# Altium schematic sheet 两个水泵三线切换.SchDoc
size OrCAD B
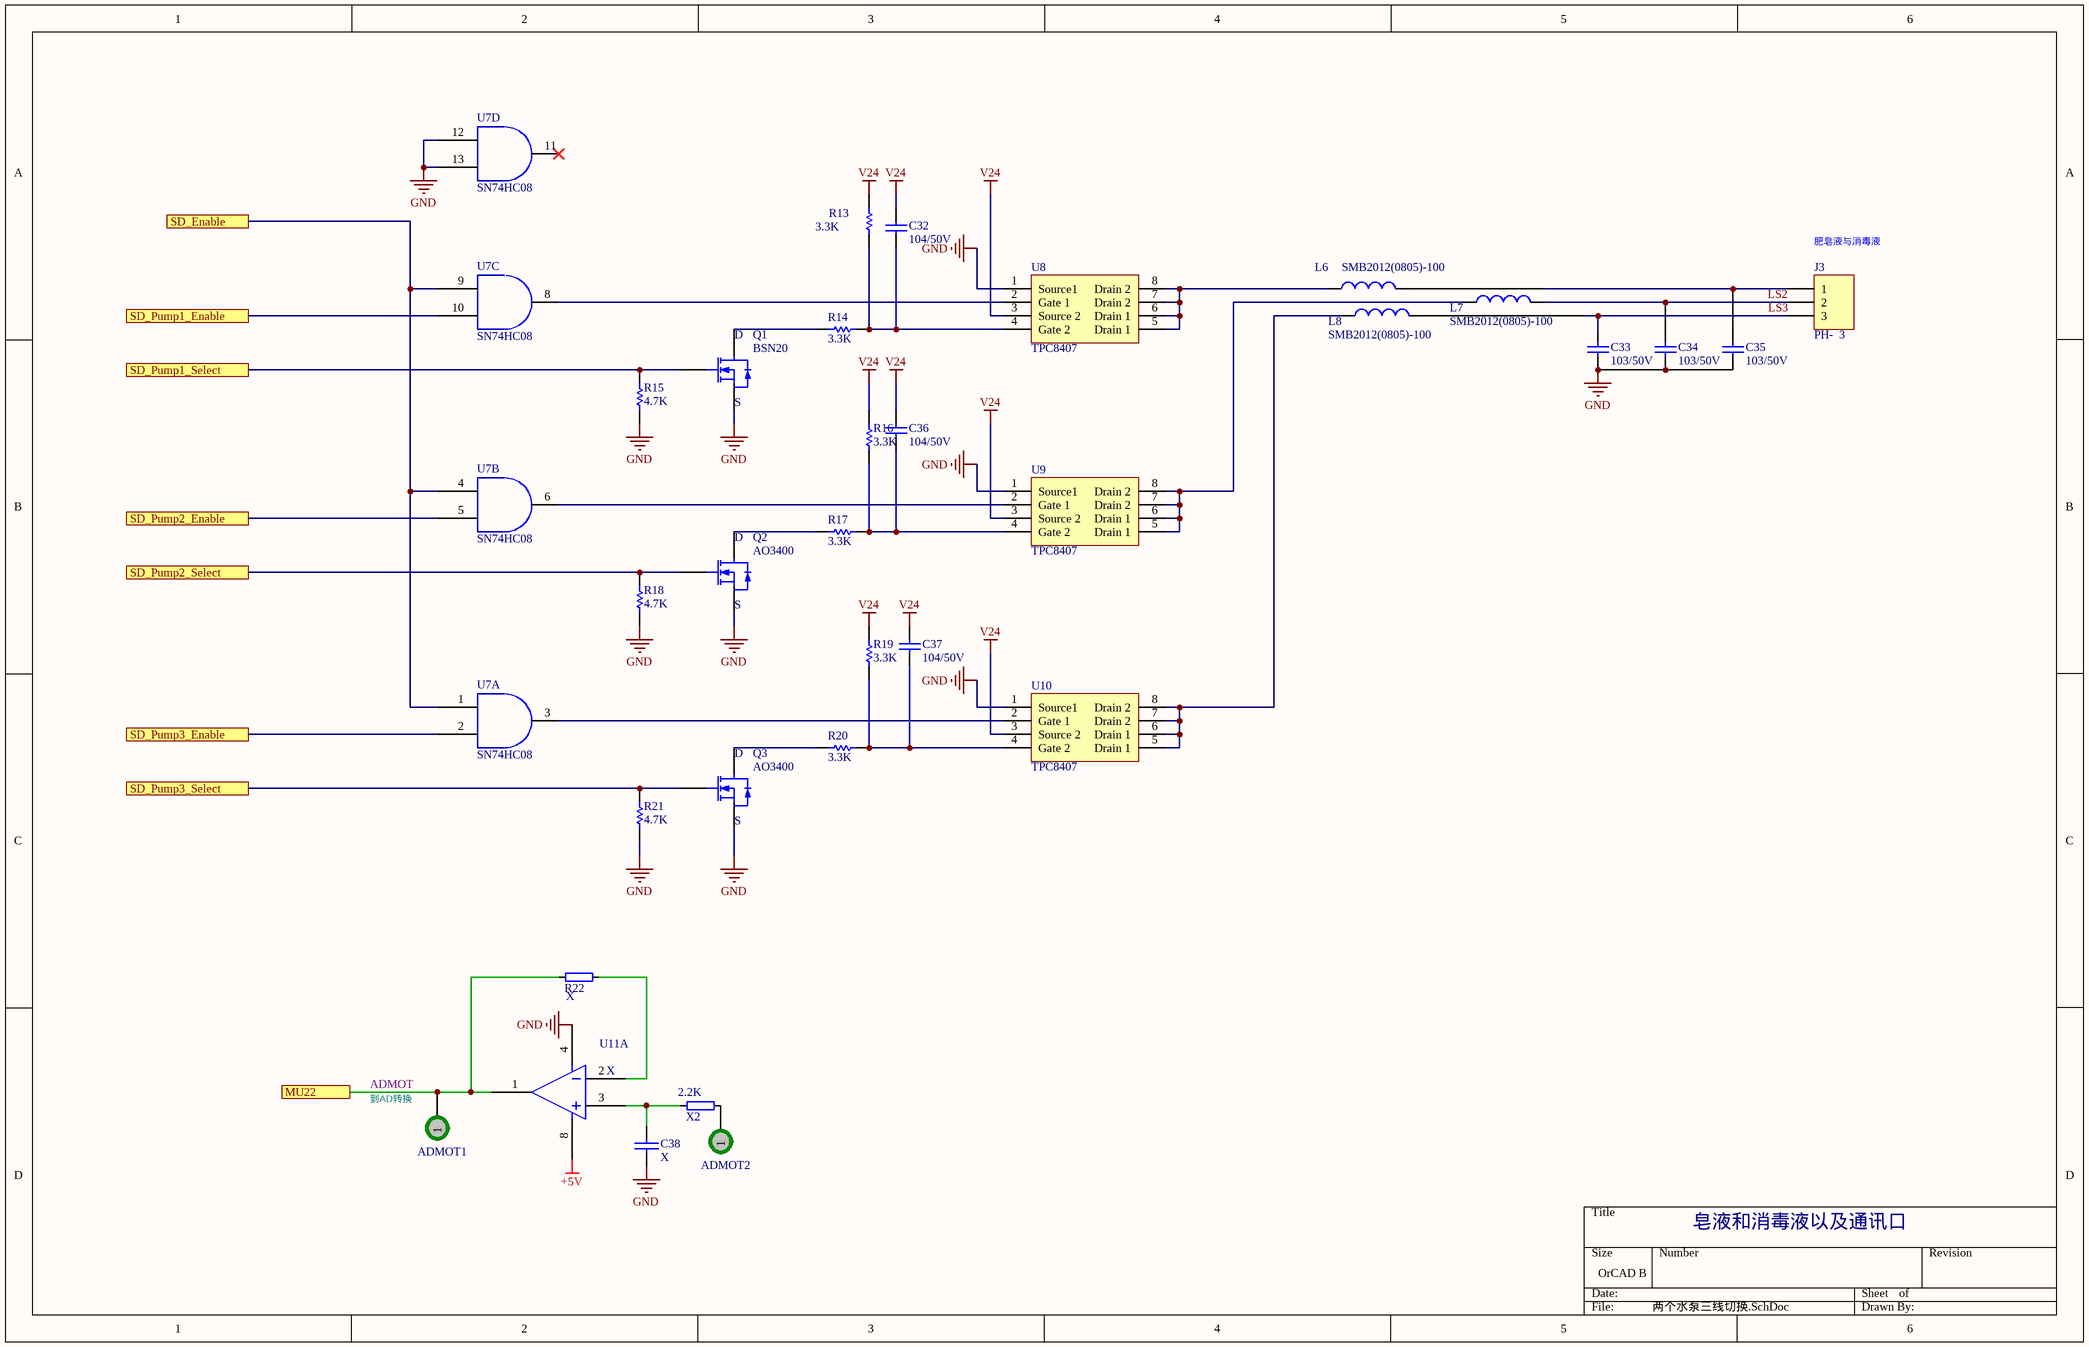
[diagram p0: 两个水泵三线切换.SchDoc]

## Parts
ADMOT1  +5V  [MesV+]  (value not drawn)
ADMOT2  +5V  [MesV+]  (value not drawn)
C32  104/50V  [1206]
C33  103/50V  [1206]
C34  103/50V  [1206]
C35  103/50V  [1206]
C36  104/50V  [1206]
C37  104/50V  [1206]
C38  X  [1206]
J3  PH-  3  [PH - 3]
L6  SMB2012(0805)-100  [6-0805]
L7  SMB2012(0805)-100  [6-0805]
L8  SMB2012(0805)-100  [6-0805]
Q1  BSN20  [AO3400]
Q2  AO3400  [SOT23N]
Q3  AO3400  [SOT23N]
R13  3.3K  [0805]
R14  3.3K  [0805]
R15  4.7K  [0805]
R16  3.3K  [0805]
R17  3.3K  [0805]
R18  4.7K  [0805]
R19  3.3K  [0805]
R20  3.3K  [0805]
R21  4.7K  [0805]
R22  X  [0805]
U7  SN74HC08  [SO-14]  (parts A,B,C,D of 4)
U8  TPC8407  [so8]
U9  TPC8407  [so8]
U10  TPC8407  [so8]
U11  X  [sop-8]  (part A of 2)
X2  2.2K  [0805]

## Ports
MU22, SD_Enable, SD_Pump1_Enable, SD_Pump1_Select, SD_Pump2_Enable, SD_Pump2_Select, SD_Pump3_Enable, SD_Pump3_Select

## Nets
+5V: U11.8
GND: C33.1 C34.1 C35.1 C38.2 Q1.2(S) Q2.2(S) Q3.2(S) R15.2 R18.2 R21.2 U7.7(GND) U7.12(4A) U7.13(4B) U8.1(Source1) U9.1(Source1) U10.1(Source1) U11.4
V24: C32.2 C36.2 C37.2 R13.1 R16.1 R19.1 U8.3(Source_2) U9.3(Source_2) U10.3(Source_2)
Vcc: U7.14(Vcc)
ADMOT: ADMOT1.1 R22.2 U11.1 ; port MU22
LS2: C34.2 J3.2 L7.2
LS3: C33.2 J3.3 L8.2
SD_Enable: U7.1(1A) U7.4(2A) U7.9(3A) ; port SD_Enable
SD_Pump1_Enable: U7.10(3B) ; port SD_Pump1_Enable
SD_Pump1_Select: Q1.1(G) R15.1 ; port SD_Pump1_Select
SD_Pump2_Enable: U7.5(2B) ; port SD_Pump2_Enable
SD_Pump2_Select: Q2.1(G) R18.1 ; port SD_Pump2_Select
SD_Pump3_Enable: U7.2(1B) ; port SD_Pump3_Enable
SD_Pump3_Select: Q3.1(G) R21.1 ; port SD_Pump3_Select
NetADMOT2_1: ADMOT2.1 X2.2
NetC32_1: C32.1 R13.2 R14.1 U8.4(Gate_2)
NetC35_2: C35.2 J3.1 L6.2
NetC36_1: C36.1 R16.2 R17.1 U9.4(Gate_2)
NetC37_1: C37.1 R19.2 R20.1 U10.4(Gate_2)
NetC38_1: C38.1 U11.3 X2.1
NetL6_1: L6.1 U8.5(Drain_1) U8.6(Drain_1) U8.7(Drain_2) U8.8(Drain_2)
NetL7_1: L7.1 U9.5(Drain_1) U9.6(Drain_1) U9.7(Drain_2) U9.8(Drain_2)
NetL8_1: L8.1 U10.5(Drain_1) U10.6(Drain_1) U10.7(Drain_2) U10.8(Drain_2)
NetQ1_3: Q1.3(D) R14.2
NetQ2_3: Q2.3(D) R17.2
NetQ3_3: Q3.3(D) R20.2
NetR22_1: R22.1 U11.2
NetU7_3: U7.3(1Y) U10.2(Gate_1)
NetU7_6: U7.6(2Y) U9.2(Gate_1)
NetU7_8: U7.8(3Y) U8.2(Gate_1)

Not connected (* = marked no-connect by the designer): U7 11(4Y)*

## Notes on the sheet
- (near J3) 肥皂液与消毒液
- (near ADMOT1) 到AD转换
- 皂液和消毒液以及通讯口

## Library data of the parts
ADMOT1 ADMOT2 = +5VPort
C32-C37 = C0603_1uF
C38 = CAP
J3 = PH-  3: Header, 3-Pin; LatestRevisionDate: 17-Jul-2002; LatestRevisionNote: Re-released for DXP Platform.; Publisher: Altium Limited
L6-L8 = Inductor: Code_IEC: 1005; Published: 8-Jun-2000; LatestRevisionDate: 17-Jul-2002; LatestRevisionNote: Re-released for DXP Platform.; PackageReference: 0402-A; Publisher: Altium Limited; Code_JEITA: 0402
Q1-Q3 = BSN20: N-Channel MOSFET; Published: 8-Jun-2000; LatestRevisionDate: 17-Jul-2002; LatestRevisionNote: Re-released for DXP Platform.; PackageVersion: 1995/1996; PackageReference: E3; Publisher: Altium Limited; PackageDescription: TO, Flat Index; 3 In-Line, Axial Leads; Body Dia. 4.6mm; Lead Dia. 0.5 mm (max)
R13 R14 R16 R17 R19 R20 = R0603_3.3K: 3.3K,0603表贴电阻
R15 R18 R21 = R0603_4.7K: 4.7K,0603表贴电阻
R22 X2 = RES
U8-U10 = TPC8407: 8pin
U11 = AD822